# Altium schematic sheet CEF Contor.SchDoc
size A; SheetNumber: 3; SheetTotal: 3
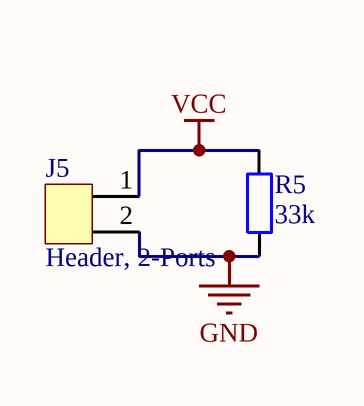
[diagram p0: CEF Contor.SchDoc]

## Parts
J5  Header, 2-Ports  [HDR_1X2_TE]
R5  33k  [Resistor]

## Nets
GND: J5.2 R5.1
VCC: J5.1 R5.2

## Library data of the parts
J5 = CON_1x2: Connector, 2-Ports
R5 = Resistor 0.25W 5mm: 0.25W,Axial